# EAGLE design ISP-Adaptor (EAGLE 6.1)
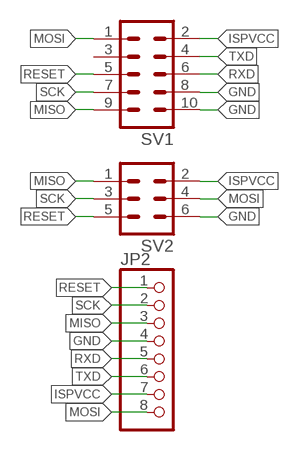
[diagram p0: schematic, sheet 1]

## Parts
JP2  PINHD-1X8  [1X08]
SV1  ML10  [ML10]
SV2  ML6  [ML6]

## Nets
GND: JP2.4 SV1.8 SV1.10 SV2.6
ISPVCC: JP2.7 SV1.2 SV2.2
MISO: JP2.3 SV1.9 SV2.1
MOSI: JP2.8 SV1.1 SV2.4
RESET: JP2.1 SV1.5 SV2.5
RXD: JP2.5 SV1.6
SCK: JP2.2 SV1.7 SV2.3
TXD: JP2.6 SV1.4
Unconnected: SV1.3

## Library data of the parts
JP2 = pinhead:PINHD-1X8: PIN HEADER
SV1 = con-harting-ml:ML10: HARTING
SV2 = con-harting-ml:ML6: HARTING; OC_FARNELL: unknown; OC_NEWARK: unknown

## Board
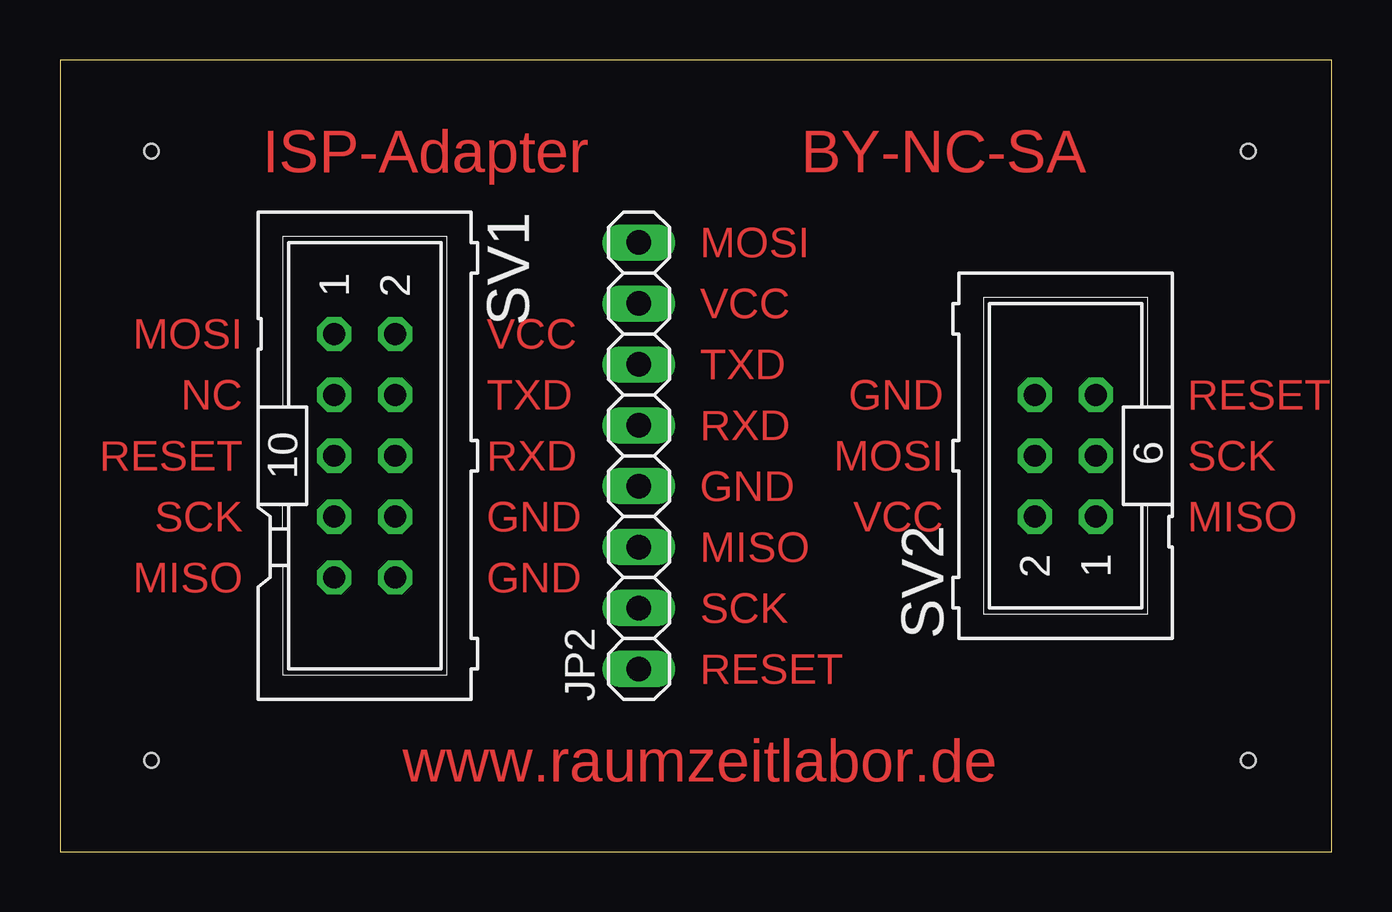
[diagram p1: board, top side]
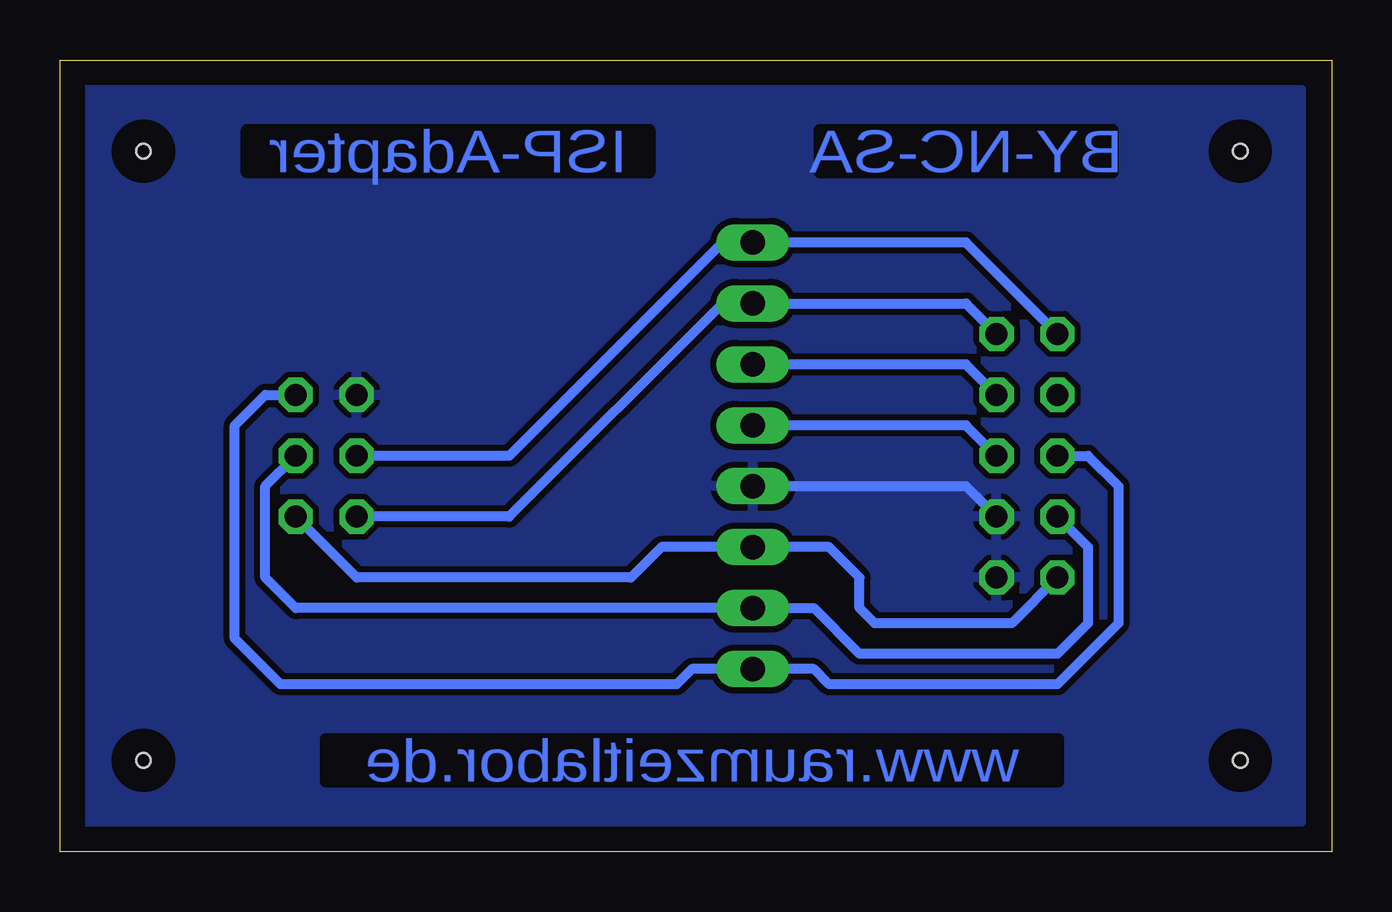
[diagram p2: board, bottom side, seen from below]

Size 53.01 x 33.01 mm. Coordinates in mm from the lower left corner, seen from the top.
Outline: 0,0 53.01,0 53.01,33.01 0,33.01 0,0
Copper layers (1*16): Top 0.035mm / dielectric 1.5mm / Bottom 0.035mm
Design rules: minimum track width 10mil, minimum drill 24mil, track to track 10mil, track to pad 10mil, pad to pad 10mil, via to via 10mil, smd to smd 10mil, copper to edge 40mil, drill to drill 8mil, minimum pad ring 10mil, minimum via ring 8mil, stop-mask expansion 4mil, vias tented up to drill 0mil, thermal gap 10mil
Holes 0.6 mm at 3.81,29.21 49.53,29.21 49.53,3.81 3.81,3.81

### Footprints (pad centres in the part's own frame; a part is rotated, then mirrored left to right if it is on the bottom)
1X08 = drill 1.016 long: 1 -8.89,0; 2 -6.35,0; 3 -3.81,0; 4 -1.27,0; 5 1.27,0; 6 3.81,0; 7 6.35,0; 8 8.89,0
ML10 = drill 0.914 octagon: 1 -5.08,-1.27; 2 -5.08,1.27; 3 -2.54,-1.27; 4 -2.54,1.27; 5 0,-1.27; 6 0,1.27; 7 2.54,-1.27; 8 2.54,1.27; 9 5.08,-1.27; 10 5.08,1.27
ML6 = drill 0.914 octagon: 1 -2.54,-1.27; 2 -2.54,1.27; 3 0,-1.27; 4 0,1.27; 5 2.54,-1.27; 6 2.54,1.27

### Placement (x,y rotation side)
JP2  24.13,16.51 90 top
SV1  12.7,16.51 270 top
SV2  41.91,16.51 90 top

### Tracks (layer width: path | path; a pad name or v marks a point on that pad's centre or on a via)
GND
  Bottom 0.406: JP2.4 15.24,15.24 SV1.8
  pour Bottom: 1.27,31.75 52.07,31.75 52.07,1.27 1.27,1.27
ISPVCC
  Bottom 0.406: SV1.2 15.24,22.86 JP2.7 25.4,22.86 34.29,13.97 SV2.2
MISO
  Bottom 0.406: SV2.1 40.64,11.43 29.21,11.43 27.94,12.7 JP2.3 20.95,12.7 19.68,11.43 19.68,10.16 19.05,9.52 13.34,9.52 SV1.9
MOSI
  Bottom 0.406: SV1.1 15.24,25.4 JP2.8 25.4,25.4 34.29,16.51 SV2.4
RESET
  Bottom 0.406: SV1.5 10.16,16.51 8.89,15.24 8.89,9.52 11.43,6.98 20.95,6.98 21.59,7.62 JP2.1 26.67,7.62 27.3,6.98 43.81,6.98 45.72,8.89 45.72,17.78 44.45,19.05 SV2.5
RXD
  Bottom 0.406: SV1.6 15.24,17.78 JP2.5
SCK
  Bottom 0.406: SV1.7 10.16,12.7 10.16,9.52 11.43,8.25 19.68,8.25 21.59,10.16 JP2.2 43.18,10.16 44.45,11.43 44.45,15.24 SV2.3
TXD
  Bottom 0.406: SV1.4 15.24,20.32 JP2.6

### Text on the board
Top: ISP-Adapter | BY-NC-SA | MOSI | VCC | MOSI | VCC | TXD | NC | TXD | GND | RESET | RXD | RESET | RXD | MOSI | SCK | GND | SCK | GND | VCC | MISO | MISO | MISO | GND | SCK | RESET | www.raumzeitlabor.de
Bottom: BY-NC-SA | ISP-Adapter | www.raumzeitlabor.de